# EAGLE design motor_driver (EAGLE 7.2.0)
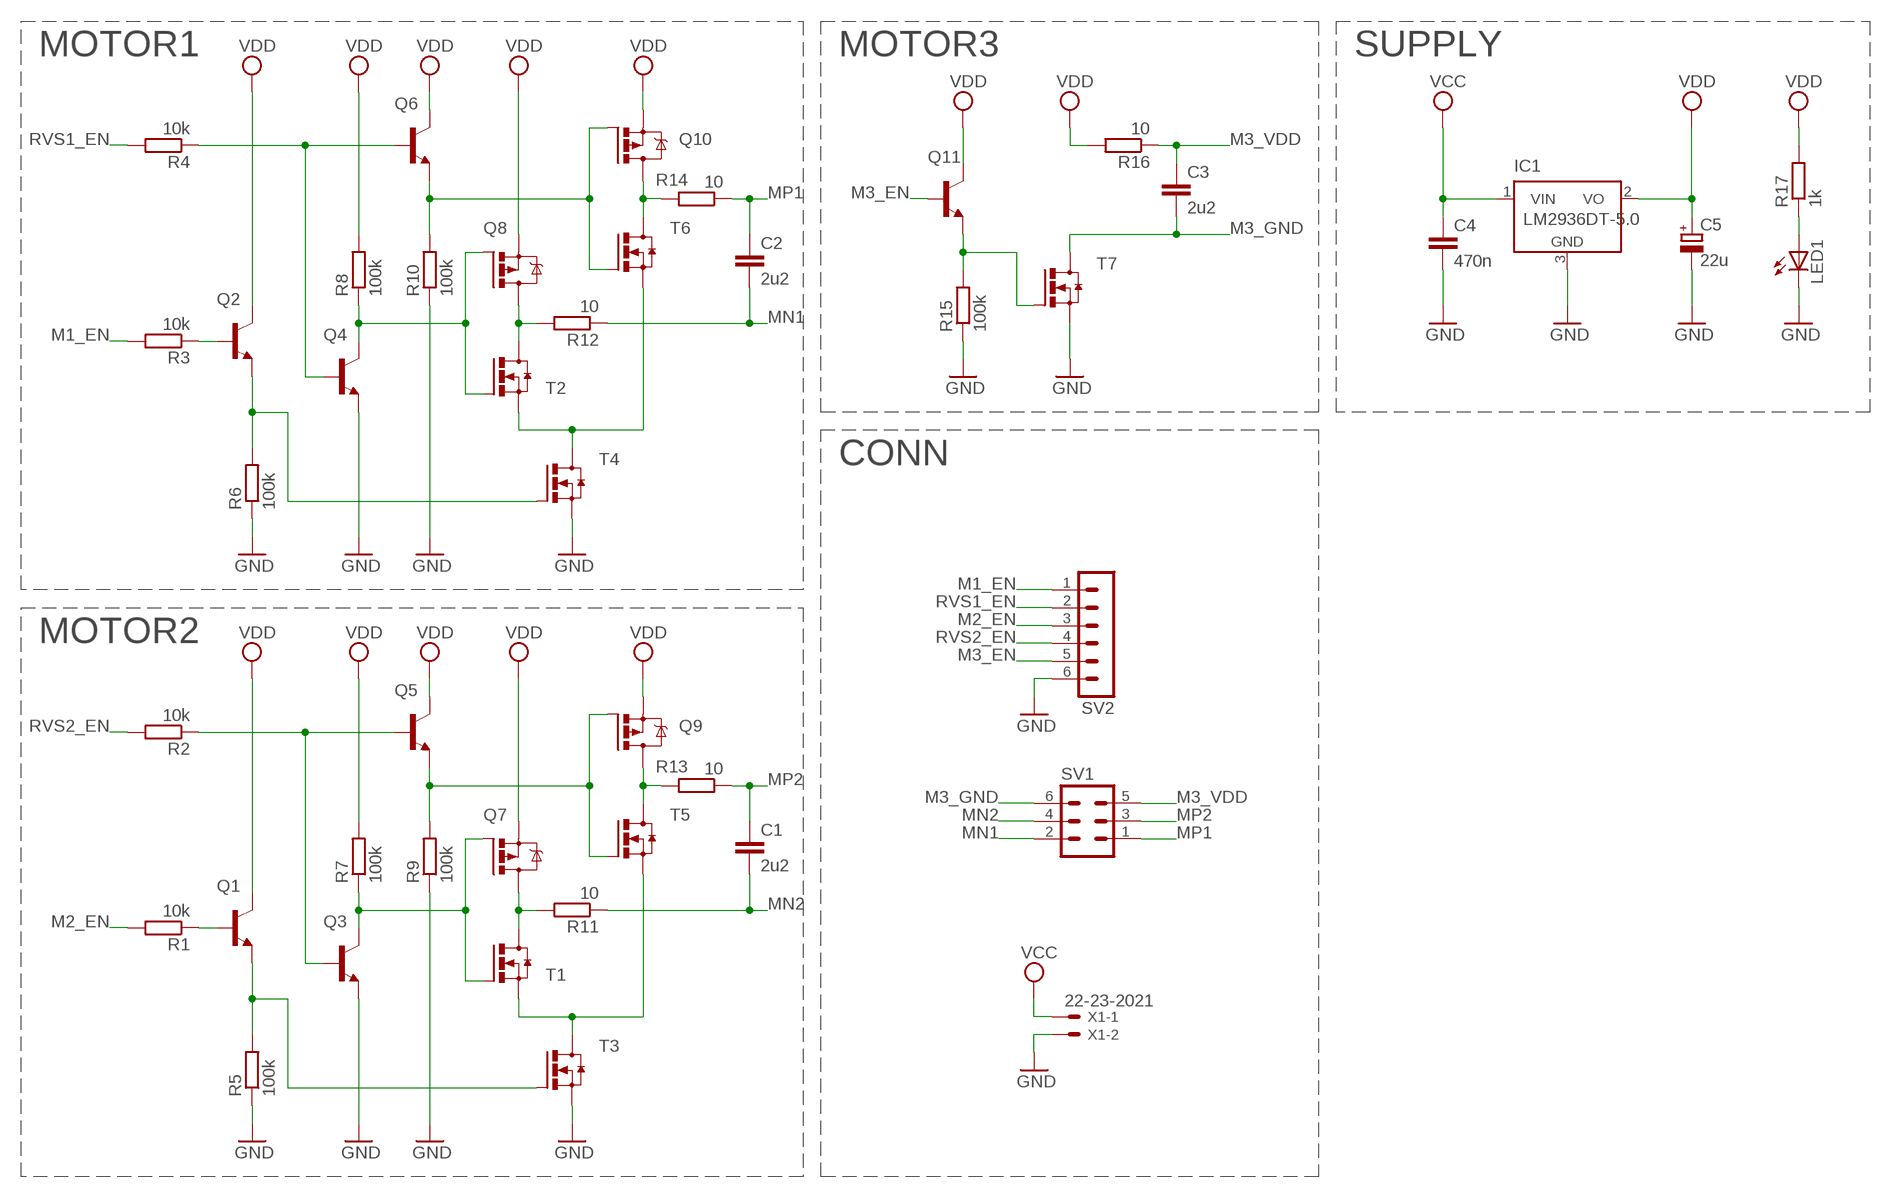
[diagram p0: schematic, sheet 1]

## Parts
C1  2u2  C-EU025-025X050  [C025-025X050]
C2  2u2  C-EU025-025X050  [C025-025X050]
C3  2u2  C-EU025-025X050  [C025-025X050]
C4  470n  C-EUC0805  [C0805]
C5  22u  CPOL-EU150CLZ-1014  [150CLZ-1014]
IC1  LM2936DT-5.0  [TO252]
LED1  LEDCHIPLED_0603  [CHIPLED_0603]
Q1  BC849SMD  [SOT23-BEC]
Q2  BC849SMD  [SOT23-BEC]
Q3  BC849SMD  [SOT23-BEC]
Q4  BC849SMD  [SOT23-BEC]
Q5  BC849SMD  [SOT23-BEC]
Q6  BC849SMD  [SOT23-BEC]
Q7  IRLML5203  [MICRO3]
Q8  IRLML5203  [MICRO3]
Q9  IRLML5203  [MICRO3]
Q10  IRLML5203  [MICRO3]
Q11  BC849SMD  [SOT23-BEC]
R1  10k  R-EU_R0603  [R0603]
R2  10k  R-EU_R0603  [R0603]
R3  10k  R-EU_R0603  [R0603]
R4  10k  R-EU_R0603  [R0603]
R5  100k  R-EU_R0603  [R0603]
R6  100k  R-EU_R0603  [R0603]
R7  100k  R-EU_R0603  [R0603]
R8  100k  R-EU_R0603  [R0603]
R9  100k  R-EU_R0603  [R0603]
R10  100k  R-EU_R0603  [R0603]
R11  10  R-EU_R2512  [R2512]
R12  10  R-EU_R2512  [R2512]
R13  10  R-EU_R2512  [R2512]
R14  10  R-EU_R2512  [R2512]
R15  100k  R-EU_R0603  [R0603]
R16  10  R-EU_R0603  [R0603]
R17  1k  R-EU_R0603  [R0603]
SV1  MA03-2  [MA03-2]
SV2  MA06-1  [MA06-1]
T1  IRLML2803  [MICRO3]
T2  IRLML2803  [MICRO3]
T3  IRLML2803  [MICRO3]
T4  IRLML2803  [MICRO3]
T5  IRLML2803  [MICRO3]
T6  IRLML2803  [MICRO3]
T7  IRLML2803  [MICRO3]
X1  22-23-2021  [22-23-2021]

## Nets
GND: C4.2 C5.- IC1.3(GND) LED1.C Q3.E Q4.E R5.1 R6.1 R9.1 R10.1 R15.1 SV2.6 T3.2(S) T4.2(S) T7.2(S) X1.2
M1_EN: R3.2 SV2.1
M2_EN: R1.2 SV2.3
M3_EN: Q11.B SV2.5
M3_GND: C3.2 SV1.6 T7.3(D)
M3_VDD: C3.1 R16.1 SV1.5
MN1: C2.2 R12.1 SV1.2
MN2: C1.2 R11.1 SV1.4
MP1: C2.1 R14.1 SV1.1
MP2: C1.1 R13.1 SV1.3
N$1: Q6.E Q10.1(G) R10.2 T6.1(G)
N$2: Q10.3(D) R14.2 T6.3(D)
N$3: Q8.3(D) R12.2 T2.3(D)
N$4: Q3.B Q5.B R2.1
N$5: Q5.E Q9.1(G) R9.2 T5.1(G)
N$6: Q2.E R6.2 T4.1(G)
N$7: Q4.B Q6.B R4.1
N$8: Q9.3(D) R13.2 T5.3(D)
N$9: Q7.3(D) R11.2 T1.3(D)
N$10: T2.2(S) T4.3(D) T6.2(S)
N$11: Q2.B R3.1
N$12: T1.2(S) T3.3(D) T5.2(S)
N$13: Q1.E R5.2 T3.1(G)
N$14: Q1.B R1.1
N$15: Q3.C Q7.1(G) R7.1 T1.1(G)
N$16: Q11.E R15.2 T7.1(G)
N$17: LED1.A R17.1
N$33: Q4.C Q8.1(G) R8.1 T2.1(G)
RVS1_EN: R4.2 SV2.2
RVS2_EN: R2.2 SV2.4
VCC: C4.1 IC1.1(VIN) X1.1
VDD: C5.+ IC1.2(VO) Q1.C Q2.C Q5.C Q6.C Q7.2(S) Q8.2(S) Q9.2(S) Q10.2(S) Q11.C R7.2 R8.2 R16.2 R17.2

## Notes on the sheet
- MOTOR1 | MOTOR3 | SUPPLY
- CONN
- MOTOR2

## Library data of the parts
C1-C4 = rcl:C-EU: CAPACITOR, European symbol
C5 = rcl:CPOL-EU: POLARIZED CAPACITOR, European symbol
IC1 = national-semiconductor:LM2936?*: Ultra-Low Quiescent Current LDO Voltage Regulator Source: Data sheet <http://www.national.com/ds/LM/LM2936.pdf>; MF: NATIONAL SEMICONDUCTOR; MPN: LM2936DT-5.0/NOPB; OC_FARNELL: 1286864; OC_NEWARK: 41K4501
LED1 = led:LED: LED OSRAM: - CHIPLED LG R971, LG N971, LY N971, LG Q971, LY Q971, LO R971, LY R971 LH N974, LH R974 LS Q976, LO Q976, LY Q976 LO Q996 - Hyper CHIPLED LW Q18S LB Q993, LB Q99A, LB R99A - SideLED LS A670, LO A670, LY A670, LG A670, LP A670 LB A673, LV A673, LT A673, LW A673 LH A674 LY A675 LS A676, LA A676, LO A676, LY A676, LW A676 LS A679, LY A679, LG A679 - Hyper Micro SIDELED® LS Y876, LA Y876, LO Y876, LY Y876 LT Y87S - SmartLED LW L88C, LW L88S LB L89C, LB L89S, LG L890 LS L89K, LO L89K, LY L89K LS L896, LA L896, LO L896, LY L896 - TOPLED LS T670, LO T670, LY T670, LG T670, LP T670 LSG T670, LSP T670, LSY T670, LOP T670, LYG T670 LG T671, LOG T671, LSG T671 LB T673, LV T673, LT T673, LW T673 LH T674 LS T676, LA T676, LO T676, LY T676, LB T676, LH T676, LSB T676, LW T676 LB T67C, LV T67C, LT T67C, LS T67K, LO T67K, LY T67K, LW E67C LS E67B, LA E67B, LO E67B, LY E67B, LB E67C, LV E67C, LT E67C LW T67C LS T679, LY T679, LG T679 LS T770, LO T770, LY T770, LG T770, LP T770 LB T773, LV T773, LT T773, LW T773 LH T774 LS E675, LA E675, LY E675, LS T675 LS T776, LA T776, LO T776, LY T776, LB T776 LHGB T686 LT T68C, LB T68C - Hyper Mini TOPLED® LB M676 - Mini TOPLED Santana® LG M470 LS M47K, LO M47K, LY M47K Source: http://www.osram.convergy.de LUXEON: - LUMILED® LXK2-PW12-R00, LXK2-PW12-S00, LXK2-PW14-U00, LXK2-PW14-V00 LXK2-PM12-R00, LXK2-PM12-S00, LXK2-PM14-U00 LXK2-PE12-Q00, LXK2-PE12-R00, LXK2-PE12-S00, LXK2-PE14-T00, LXK2-PE14-U00 LXK2-PB12-K00, LXK2-PB12-L00, LXK2-PB12-M00, LXK2-PB14-N00, LXK2-PB14-P00, LXK2-PB14-Q00 LXK2-PR12-L00, LXK2-PR12-M00, LXK2-PR14-Q00, LXK2-PR14-R00 LXK2-PD12-Q00, LXK2-PD12-R00, LXK2-PD12-S00 LXK2-PH12-R00, LXK2-PH12-S00 LXK2-PL12-P00, LXK2-PL12-Q00, LXK2-PL12-R00 Source: www.luxeon.com KINGBRIGHT: KA-3528ASYC Source: www.kingbright.com
Q1-Q6 Q11 = transistor-npn:BC849*: NPN Transistor
Q7-Q10 = transistor-power:IRLML5203: HEXFET P-Channel Power MOSFET
R1-R17 = rcl:R-EU_: RESISTOR, European symbol
SV1 = con-lstb:MA03-2: PIN HEADER; OC_FARNELL: unknown; OC_NEWARK: unknown
SV2 = con-lstb:MA06-1: PIN HEADER; OC_FARNELL: unknown; OC_NEWARK: unknown
T1-T7 = transistor-power:IRLML2803: HEXFET Power N-Channel MOSFET
X1 = con-molex:22-23-2021: .100" (2.54mm) Center Header - 2 Pin; MF: MOLEX; MPN: 22-23-2021; OC_FARNELL: 1462926; OC_NEWARK: 25C3832

## Board
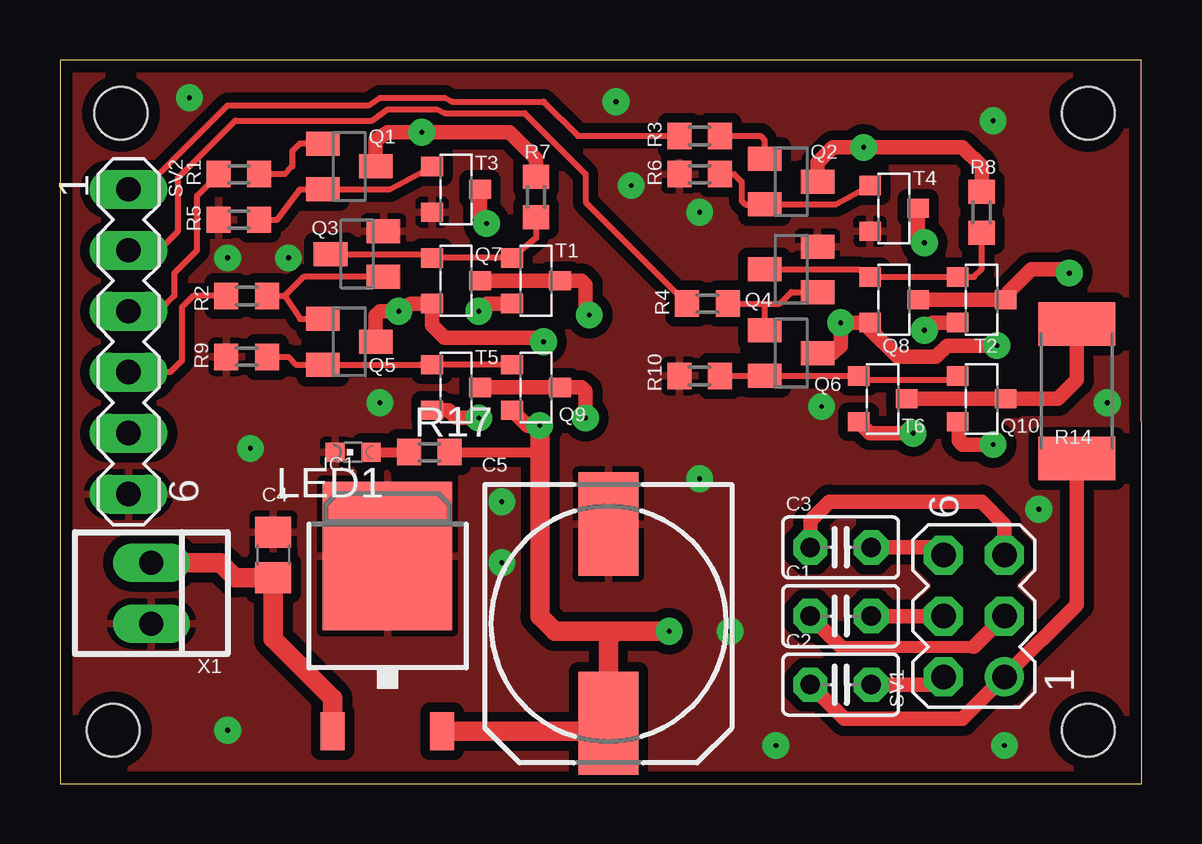
[diagram p1: board, top side]
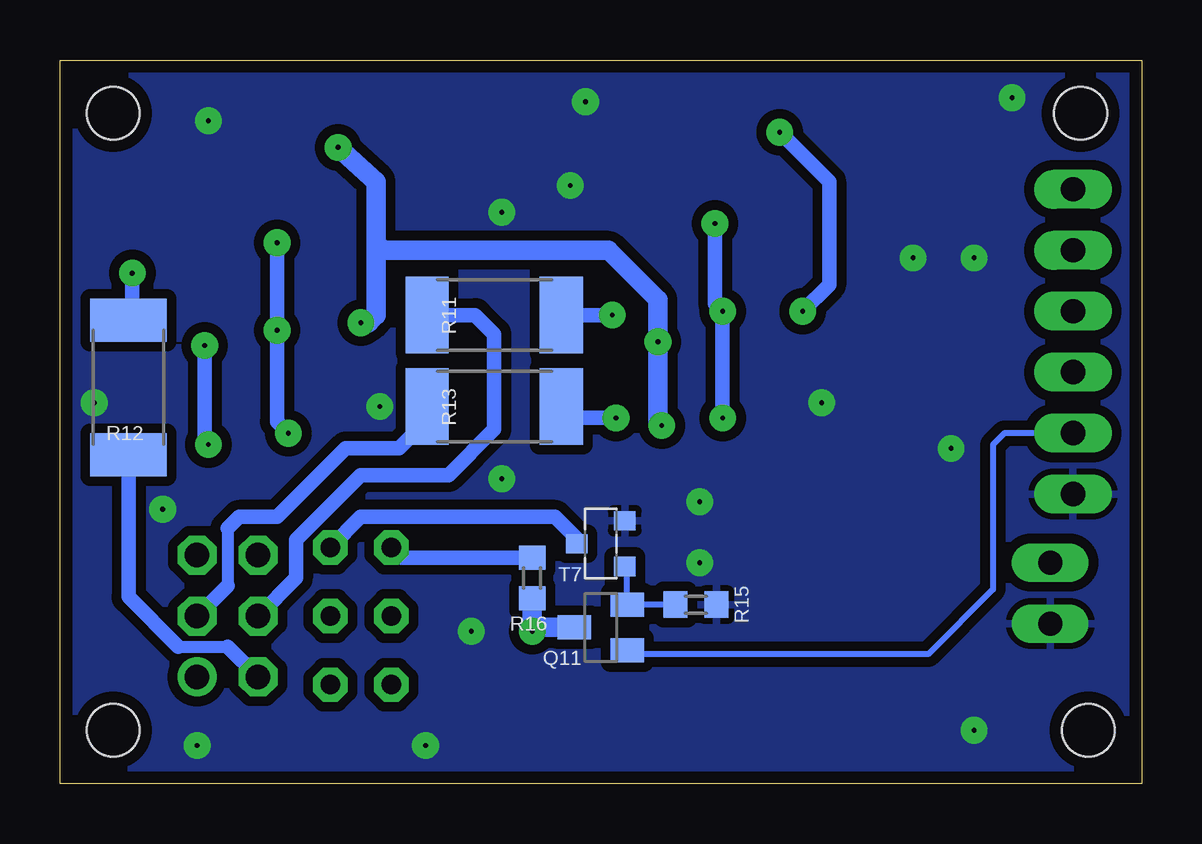
[diagram p2: board, bottom side, seen from below]

Size 45.09 x 30.16 mm. Coordinates in mm from the lower left corner, seen from the top.
Outline: 0,0.01 45.09,0 45.07,30.16 0,30.16 0,0.01
Copper layers (1*16): Top 0.035mm / dielectric 1.5mm / Bottom 0.035mm
Design rules "default *": minimum track width 10mil, minimum drill 2mil, track to track 8mil, track to pad 8mil, pad to pad 8mil, via to via 8mil, smd to smd 8mil, copper to edge 20mil, drill to drill 8mil, minimum pad ring 12mil, minimum via ring 18mil, stop-mask expansion 4mil, vias tented up to drill 0mil, thermal gap 10mil
Holes 2.2 mm at 42.86,27.95 42.86,2.24 2.22,2.24 2.54,27.95

### Footprints (pad centres in the part's own frame; a part is rotated, then mirrored left to right if it is on the bottom)
C025-025X050 = drill 0.813 octagon: 1 -1.27,0; 2 1.27,0
C0805 = smd 1.3 x 1.5: 1 -0.95,0; 2 0.95,0
150CLZ-1014 = smd 4.3 x 2.5: + 4.15,0; - -4.15,0
TO252 = smd 1 x 1.6: 1 -2.28,-4.8; 2 2.28,-4.8 | smd 5.4 x 6.2: 3 0,2.5
CHIPLED_0603 = smd 0.8 x 0.8: A 0,-0.75; C 0,0.75
SOT23-BEC = smd 1 x 1.4: B -0.95,-1.1; C 0,1.1; E 0.95,-1.1
MICRO3 = smd 0.8 x 0.9: 1 -0.95,-1; 2 0.95,-1; 3 0,1
R0603 = smd 1 x 1.1: 1 -0.85,0; 2 0.85,0
R2512 = smd 1.8 x 3.2: 1 -2.8,0; 2 2.8,0
MA03-2 = drill 1.016: 1 -2.54,-1.27 | drill 1.016 octagon: 2 -2.54,1.27; 3 0,-1.27; 4 0,1.27; 5 2.54,-1.27; 6 2.54,1.27
MA06-1 = drill 1.016 long: 1 -6.35,0; 2 -3.81,0; 3 -1.27,0; 4 1.27,0; 5 3.81,0; 6 6.35,0
22-23-2021 = drill 1 long: 1 -1.27,0; 2 1.27,0

### Placement (x,y rotation side)
C1  32.54,7 0 top
C2  32.54,4.14 0 top
C3  32.54,9.85 0 top
C4  8.89,9.54 90 top
C5  22.86,6.68 270 top
IC1  13.65,7 0 top
LED1  12.22,13.82 90 top
Q1  12.06,25.73 270 top
Q2  30.48,25.09 270 top
Q3  12.38,22.08 90 top
Q4  30.48,21.44 90 top
Q5  12.06,18.43 270 top
Q6  30.48,17.95 270 top
Q7  16.51,20.97 270 top
Q8  34.77,20.17 270 top
Q9  19.84,16.52 270 top
Q10  38.42,16.05 270 top
Q11  22.54,6.52 90 bottom
R1  7.46,25.41 180 top
R2  7.78,20.33 180 top
R3  26.67,27 180 top
R4  26.99,20.02 180 top
R5  7.46,23.51 0 top
R6  26.67,25.41 0 top
R7  19.84,24.46 90 top
R8  38.42,23.82 90 top
R9  7.78,17.79 0 top
R10  26.67,17 0 top
R11  26.99,19.54 0 bottom
R12  42.23,16.52 90 bottom
R13  26.99,15.73 0 bottom
R14  42.39,16.36 90 top
R15  18.57,7.47 180 bottom
R16  25.4,8.58 270 bottom
R17  15.4,13.82 0 top
SV1  38.1,7 90 top
SV2  2.86,18.43 270 top
T1  19.84,20.97 270 top
T2  38.42,20.17 270 top
T3  16.51,24.78 270 top
T4  34.77,23.98 270 top
T5  16.51,16.52 270 top
T6  34.29,16.05 270 top
T7  22.54,10.01 90 bottom
X1  3.81,7.95 270 top

### Tracks (layer width: path | path; a pad name or v marks a point on that pad's centre or on a via)
GND  (via drill 0.2)
  other vias: 26.67,23.82 23.81,24.94 31.75,15.73 18.41,9.22 26.67,12.71 18.41,11.76 27.94,6.36 13.34,15.89 6.99,21.92 7.94,13.98 23.18,28.43 38.89,27.63 43.66,15.89 40.8,11.44 39.37,1.6 29.84,1.6 6.99,2.24 5.4,28.59 9.53,21.92
  pour Top (isolate 0.406): 45.88,33.51 -3.17,33.51 -3.17,-2.05 45.88,-2.05
  pour Bottom (isolate 0.406): -3.97,34.78 46.99,34.78 46.99,-3.96 -3.97,-3.96
M1_EN
  Top 0.254: SV2.1 3.49,24.78 6.99,28.27 12.86,28.27 13.34,28.59 16.03,28.59 16.35,28.43 20.16,28.43 21.59,27 R3.2
M2_EN
  Top 0.254: SV2.3 4.13,19.7 4.76,20.33 4.76,21.29 5.71,22.24 5.71,24.52 R1.2
M3_EN
  Bottom 0.254: SV2.5 5.71,14.62 6.19,14.14 6.19,8.11 8.89,5.41 21.28,5.41 Q11.B
M3_GND
  Top 0.61: C3.2 36.51,9.85 SV1.6
  Bottom 0.61: T7.3 23.54,10.22 24.45,11.13 32.54,11.13 C3.2
M3_VDD
  Top 0.61: C3.1 31.27,10.97 32.07,11.76 38.42,11.76 39.37,10.81 SV1.5
  Bottom 0.61: R16.1 30.85,9.43 C3.1
MN1
  Top 0.61: C2.2 36.51,4.14 SV1.2
  Bottom 0.508: 40.16,5.73 38.1,5.73
  Bottom 0.61: R12.1 42.23,7.79 40.16,5.73 | 38.1,5.73 SV1.2
MN2
  Top 0.61: C1.2 SV1.4
  Bottom 0.61: R11.1 27.78,19.54 26.99,18.75 26.99,14.78 28.89,12.87 32.54,12.87 35.24,10.17 35.24,8.58 SV1.4
MP1
  Top 0.61: C2.1 32.7,2.71 37.62,2.71 SV1.1 42.39,7.47 R14.1
MP2
  Top 0.508: 32.54,5.73 38.1,5.73
  Top 0.61: C1.1 32.54,5.73 | 38.1,5.73 SV1.3
  Bottom 0.508: 38.1,10.65 38.1,8.27
  Bottom 0.61: 38.1,10.65 37.62,11.13 36.04,11.13 33.18,13.98 30.96,13.98 29.84,15.09 29.84,15.67 R13.1 | 38.1,8.27 SV1.3
N$1
  Top 0.254: R10.2 Q6.E 33.13,17 T6.1 33.34,17 33.5,16.84 37.26,16.84 Q10.1
N$2
  Top 0.61: T6.3 Q10.3 41.59,16.05 42.39,16.84 R14.2
N$3  (via drill 0.2)
  Top 0.61: Q8.3 T2.3 39.53,20.49 40.48,21.44 41.91,21.44 v42.07,21.29
  Bottom 0.61: v42.07,21.29 42.07,19.48 R12.2
N$4
  Top 0.254: R2.1 9.37,20.33 | 11.44,19.38 10,19.38 9.37,20.33 | Q3.B 10.16,21.13 9.37,20.33
  Top 0.305: 11.44,19.38 Q5.B
N$5
  Top 0.254: R9.2 9.53,17.79 9.84,17.47 11.44,17.47 | Q9.1 T5.1 15.03,17.48 Q5.E
  Top 0.305: 11.44,17.47 Q5.E
N$6
  Top 0.254: T4.1 32.34,24.15 Q2.E 28.57,24.14 28.42,24.3 28.42,25.09 28.1,25.41 R6.2
N$7
  Top 0.254: R4.1 29.37,20.02 | 29.37,20.02 30,20.02 30.48,20.49 Q4.B | Q6.B 29.38,20 29.37,20.02
N$8  (via drill 0.2)
  Top 0.61: T5.3 Q9.3 21.75,16.52 21.91,16.36 v21.91,15.25
  Bottom 0.61: v21.91,15.25 23.55,15.25 R13.2
N$9  (via drill 0.2)
  Top 0.61: Q7.3 T1.3 21.75,20.97 21.91,20.81 21.91,19.7 v22.07,19.54
  Bottom 0.61: v22.07,19.54 R11.2
N$10  (via drill 0.2)
  Top 0.61: T4.3 35.77,22.82 v36.04,22.56 | v35.56,14.62 33.77,14.62 T6.2 | T2.2 36.36,19.22 v36.04,18.9
  Bottom 0.61: v36.04,22.56 v36.04,18.9 36.04,15.09 v35.56,14.62
N$11
  Top 0.254: R3.1 29.21,27 29.37,26.84 29.37,26.06 Q2.B
N$12  (via drill 0.2, 0.2 pad 0.81)
  Top 0.61: T5.2 16.19,15.57 16.51,15.25 v17.46,15.25 | T3.3 17.51,23.62 v17.78,23.35 | T1.2 17.78,20.02 v17.46,19.7
  Bottom 0.61: v17.46,15.25 v17.46,19.7 17.78,20.02 v17.78,23.35
N$13
  Top 0.254: T3.1 13.77,24.78 Q1.E 10,24.78 9.05,23.51 R5.2
N$14
  Top 0.254: Q1.B 10,26.68 9.68,26.36 9.68,25.73 9.37,25.41 R1.1
N$15
  Top 0.254: Q3.C 15.19,22.08 Q7.1 T1.1 19.84,22.76 R7.1
N$16
  Bottom 0.254: R15.2 Q11.E 21.44,8.96 T7.1
N$17
  Top 0.406: LED1.A R17.1
N$33
  Top 0.254: Q4.C 33.29,21.44 Q8.1 T2.1 38.1,21.12 38.42,21.44 R8.1
RVS1_EN
  Top 0.254: SV2.2 4.13,22.24 4.92,23.03 4.92,25.25 7.3,27.63 13.02,27.63 13.65,28.11 15.72,28.11 16.03,27.95 19.37,27.95 21.91,25.41 21.91,24.25 R4.2
RVS2_EN
  Top 0.254: R2.2 5.56,20.33 5.08,19.86 5.08,17.63 4.6,17.16 SV2.4
VCC
  Top 0.813: X1.1 6.67,9.22 7.3,8.59 C4.1 8.89,6.04 11.37,3.56 IC1.1
VDD  (via drill 0.2)
  Top 0.406: R17.2 20,13.82 20,13.98
  Top 0.61: Q1.C 13.16,26.83 13.65,27.16 v15.08,27.16 18.73,27.16 19.84,26.05 R7.2 | Q5.C 13.16,19.53 13.34,19.7 v14.13,19.7 14.61,20.02 Q7.2 15.51,19.11 16.03,18.59 20,18.59 v20.16,18.43 | v20,14.93 19.48,14.93 Q9.2 | Q2.C 31.58,25.88 32.23,26.52 v33.5,26.52 37.62,26.52 38.42,25.73 R8.2 | v38.89,14.14 37.62,14.14 37.47,14.3 37.47,15.05 Q10.2 | Q6.C 32.23,17.95 32.54,18.27 v32.54,19.22 32.7,19.22 Q8.2 33.77,18.95 34.92,17.79 36.51,17.79 36.99,18.27 v39.05,18.27
  Top 0.813: IC1.2 22.84,2.2 C5.+ 22.86,6.04 23.18,6.36 | v20,14.93 20,13.98 20,7 20.64,6.36 23.18,6.36 | 23.18,6.36 v25.4,6.36
  Bottom 0.61: 20.16,15.09 v20,14.93 | v15.08,27.16 13.02,25.09 13.02,20.81 v14.13,19.7 | 32.07,19.38 31.91,19.54 | v39.05,18.27 39.05,14.3 v38.89,14.14
  Bottom 0.813: 20.16,15.09 v20.16,18.43 20.16,20.17 22.23,22.24 31.59,22.24 31.91,22.56 | v32.54,19.22 32.23,19.22 32.07,19.38 | 31.91,19.54 31.91,22.56 | 31.91,22.56 31.91,25.09 v33.5,26.52 | R16.2 v25.4,6.36 25.24,6.52 Q11.C